# EAGLE schematic LionDrillCharger2 (EAGLE 7.2.0)
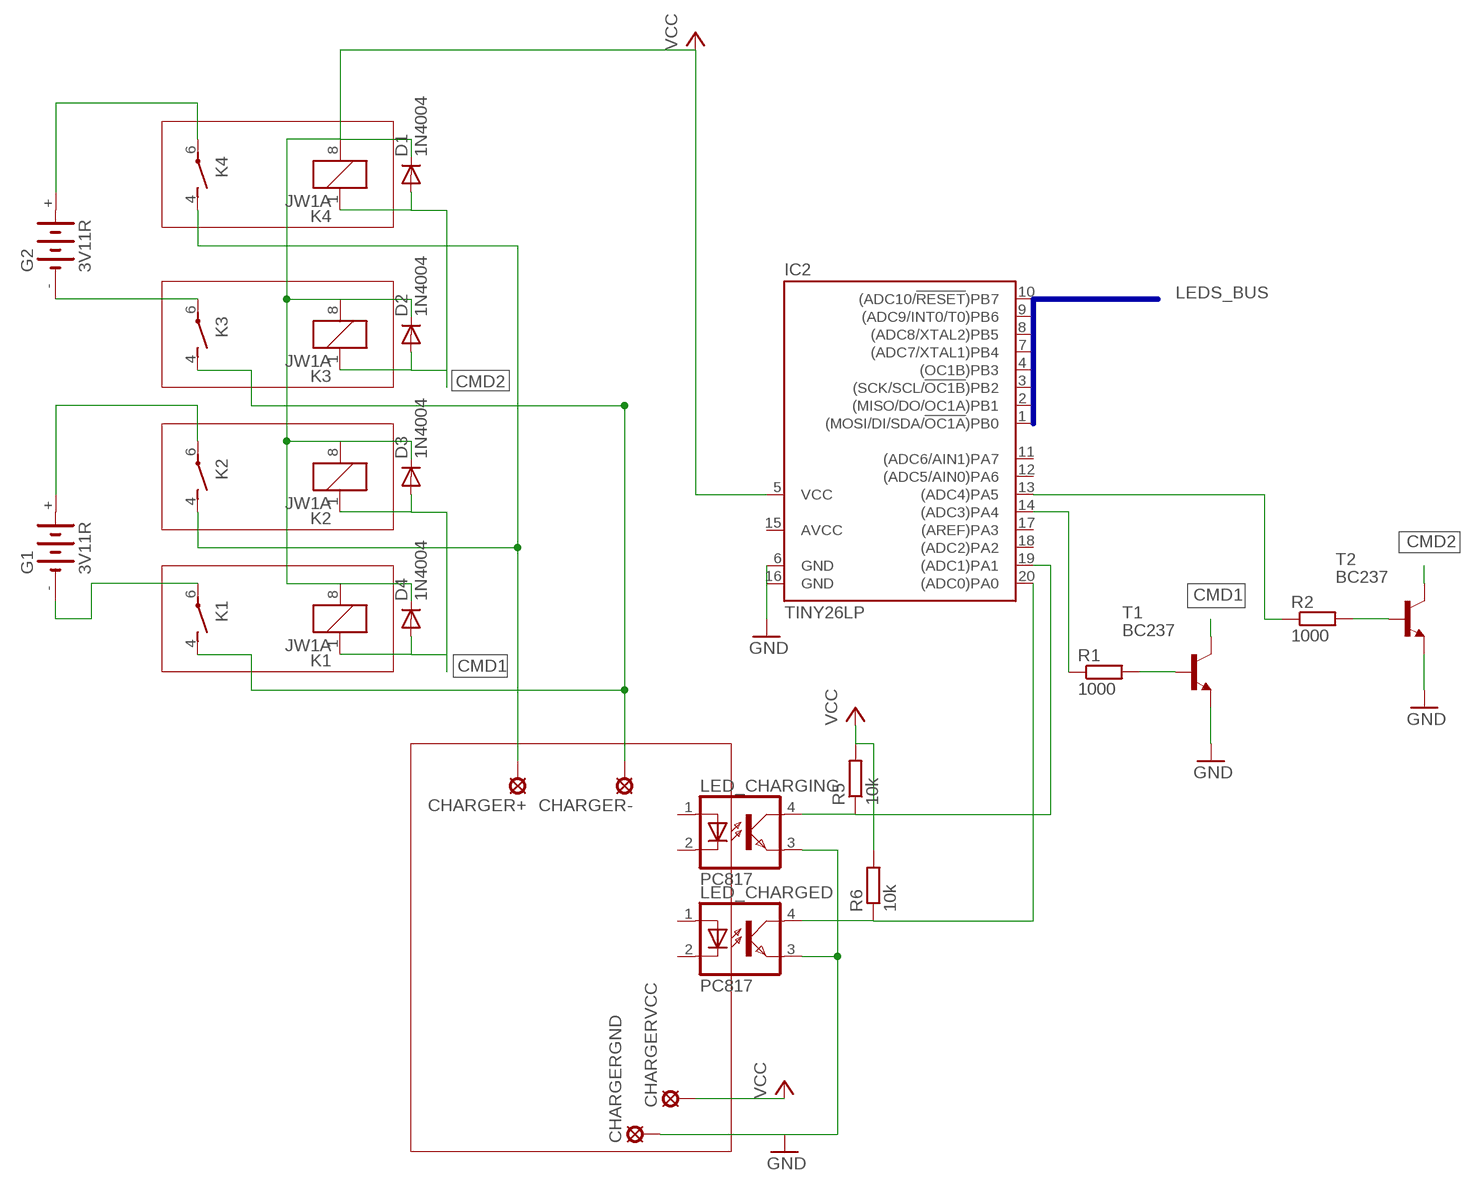
[diagram p0: schematic, sheet 1]

## Parts
CHARGER+  LSP11  [LSP11]
CHARGER-  LSP11  [LSP11]
CHARGERGND  LSP11  [LSP11]
CHARGERVCC  LSP11  [LSP11]
D1  1N4004  [DO41-10]
D2  1N4004  [DO41-10]
D3  1N4004  [DO41-10]
D4  1N4004  [DO41-10]
G1  3V11R  [3V11R]
G2  3V11R  [3V11R]
IC2  TINY26LP  [DIL20]
K1  JW1A  [JW1A]
K2  JW1A  [JW1A]
K3  JW1A  [JW1A]
K4  JW1A  [JW1A]
LED_CHARGED  PC817  [DIL04]
LED_CHARGING  PC817  [DIL04]
R1  1000  R-EU_0204/5  [0204/5]
R2  1000  R-EU_0204/5  [0204/5]
R5  10k  R-EU_0204/5  [0204/5]
R6  10k  R-EU_0204/5  [0204/5]
T1  BC237  [TO92]
T2  BC237  [TO92]

## Nets
CMD1: D3.A D4.A K1.1 K2.1 T1.3(C)
CMD2: D1.A D2.A K3.1 K4.1 T2.3(C)
GND: T1.1(E) T2.1(E)
N$1: CHARGER+.MP K2.4(1:S) K4.4(1:S)
N$2: R1.2 T1.2(B)
N$3: G2.+ K4.6(1:P)
N$4: G1.+ K2.6(1:P)
N$5: G1.- K1.6(1:P)
N$6: G2.- K3.6(1:P)
N$7: CHARGER-.MP K1.4(1:S) K3.4(1:S)
N$8: R2.2 T2.2(B)
N$11: R1.1
N$12: R2.1
N$16: CHARGERVCC.MP
N$17: CHARGERGND.MP LED_CHARGED.3(EMIT) LED_CHARGING.3(EMIT)
N$18: IC2.19((ADC1)PA1) LED_CHARGING.4(COL) R5.1
N$19: IC2.20((ADC0)PA0) LED_CHARGED.4(COL) R6.1
VCC: D1.C D2.C D3.C D4.C K1.8 K2.8 K3.8 K4.8 R5.2 R6.2
Unconnected: IC2.1((MOSI/DI/SDA/!OC1A!)PB0) IC2.2((MISO/DO/OC1A)PB1) IC2.3((SCK/SCL/!OC1B!)PB2) IC2.4((OC1B)PB3) IC2.7((ADC7/XTAL1)PB4) IC2.8((ADC8/XTAL2)PB5) IC2.9((ADC9/INT0/T0)PB6) IC2.10((ADC10/!RESET!)PB7) IC2.11((ADC6/AIN1)PA7) IC2.12((ADC5/AIN0)PA6) IC2.13((ADC4)PA5) IC2.14((ADC3)PA4) IC2.17((AREF)PA3) IC2.18((ADC2)PA2) LED_CHARGED.1(A) LED_CHARGED.2(C) LED_CHARGING.1(A) LED_CHARGING.2(C)

## Buses
LEDS_BUS

## Power pins joined to a net without a drawn wire
AVCC: IC2.15(AVCC)
GND: IC2.6(GND) IC2.16(GND)
VCC: IC2.5(VCC)

## Library data of the parts
CHARGER+ CHARGER- CHARGERGND CHARGERVCC = solpad:LSP11: SOLDER PAD drill 1.1 mm
D1-D4 = diode:1N4004: DIODE general purpose rectifier, 1 A
G1 G2 = battery:3V11R: NC ACCU Varta
IC2 = atmel:TINY26*: 8-bit AVR Microcontroller with 2K Bytes Flash Source: http://www.atmel.com .. doc1477.pdf; MPN: ATTINY26L-8PU; OC_FARNELL: 9171657; OC_NEWARK: 01M6920
K1-K4 = relay:JW1A: Power relay Source: Panasonic Electric Works Co., Ltd. / jw.catalog.pdf
LED_CHARGED LED_CHARGING = optocoupler:PC817: SHARP OPTO COUPLER; MPN: PC817X4J000F; OC_FARNELL: 9707727; OC_NEWARK: 97K7059
R1 R2 R5 R6 = resistor:R-EU_: RESISTOR, European symbol
T1 T2 = transistor:BC237: NPN TRANSISTOR